# Altium schematic sheet Connectors.SchDoc
size A4; DocumentNumber: 4; SheetNumber: 4; SheetTotal: 4
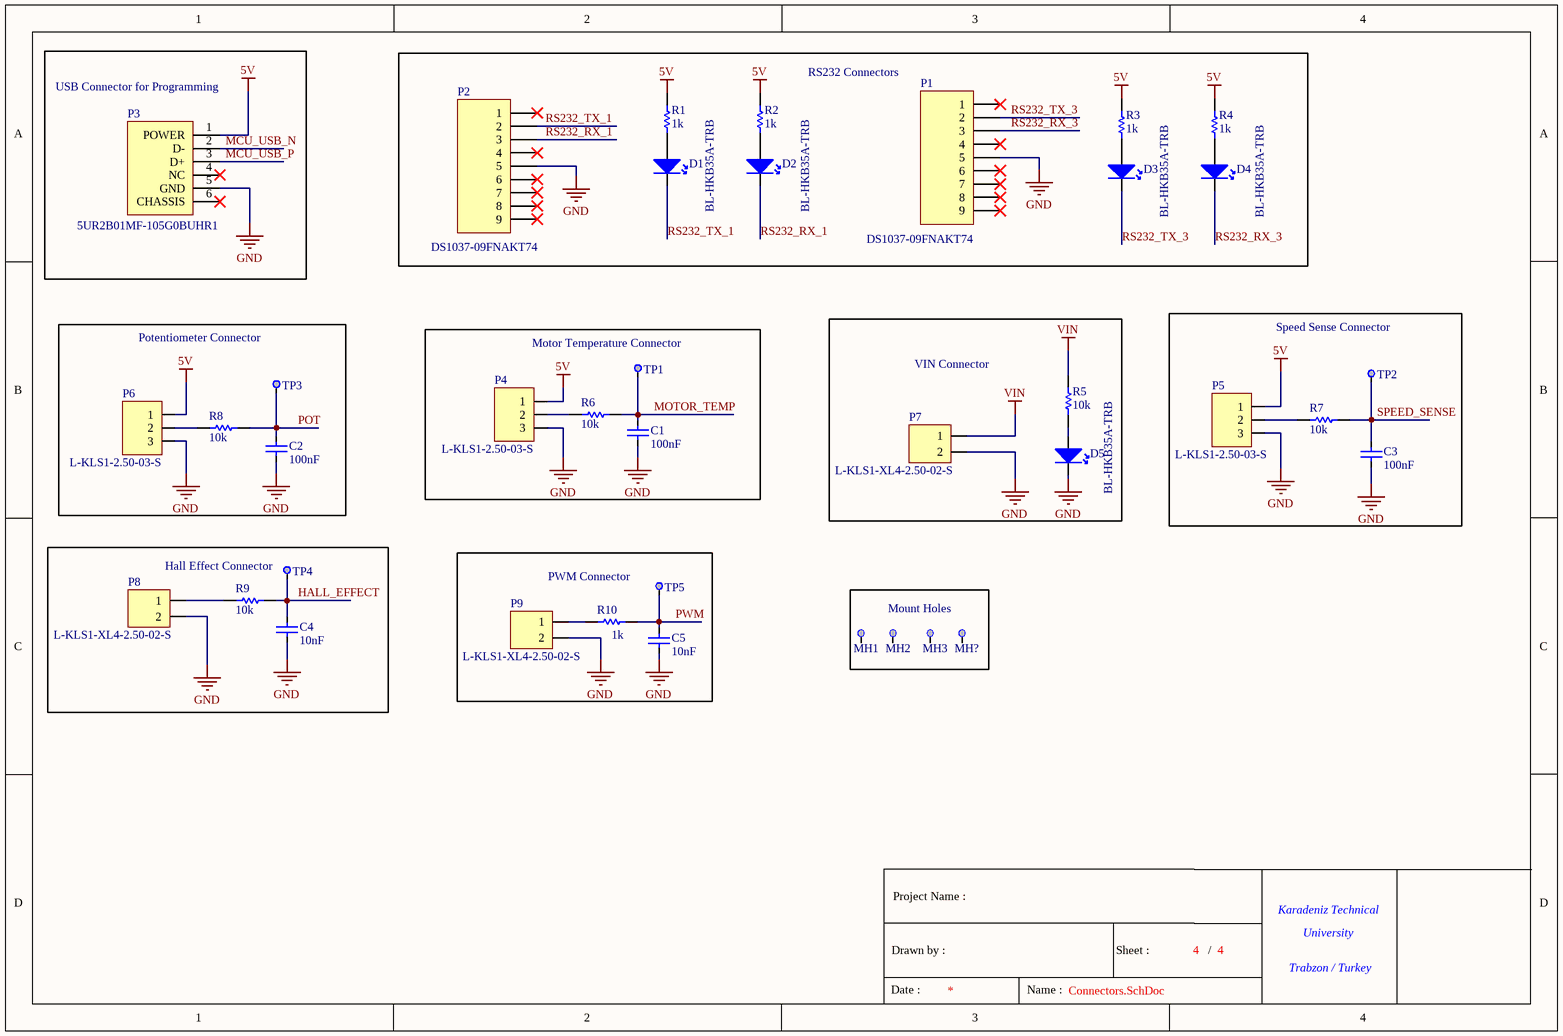
[diagram p0: Connectors.SchDoc]

## Parts
?  (no value)  (graphical)
C1  100nF  [CAP-0603]
C2  100nF  [CAP-0603]
C3  100nF  [CAP-0603]
C4  10nF  [CAP-0603]
C5  10nF  [CAP-0603]
D1  BL-HKB35A-TRB  [LED-0805]
D2  BL-HKB35A-TRB  [LED-0805]
D3  BL-HKB35A-TRB  [LED-0805]
D4  BL-HKB35A-TRB  [LED-0805]
D5  BL-HKB35A-TRB  [LED-0805]
MH1  3mm Mounting Hole  [3mm Mounting Hole]  (value not drawn)  (no BOM)
MH2  3mm Mounting Hole  [3mm Mounting Hole]  (value not drawn)  (no BOM)
MH3  3mm Mounting Hole  [3mm Mounting Hole]  (value not drawn)  (no BOM)
MH?  3mm Mounting Hole  [3mm Mounting Hole]  (value not drawn)  (no BOM)
P1  DS1037-09FNAKT74  [D SUB 9PIN FEMALE 90C TH]
P2  DS1037-09FNAKT74  [D SUB 9PIN FEMALE 90C TH]
P3  5UR2B01MF-105G0BUHR1  [MICRO USB B SMD]
P4  L-KLS1-2.50-03-S  [3PIN MALE 180C TH 2.5mm]
P5  L-KLS1-2.50-03-S  [3PIN MALE 180C TH 2.5mm]
P6  L-KLS1-2.50-03-S  [3PIN MALE 180C TH 2.5mm]
P7  L-KLS1-XL4-2.50-02-S  [2 PIN MALE 180C TH 2.50MM]
P8  L-KLS1-XL4-2.50-02-S  [2 PIN MALE 180C TH 2.50MM]
P9  L-KLS1-XL4-2.50-02-S  [2 PIN MALE 180C TH 2.50MM]
R1  1k  [RES-0603]
R2  1k  [RES-0603]
R3  1k  [RES-0603]
R4  1k  [RES-0603]
R5  10k  [RES-0603]
R6  10k  [RES-0603]
R7  10k  [RES-0603]
R8  10k  [RES-0603]
R9  10k  [RES-0603]
R10  1k  [RES-0603]
TP1  Test Point  [0.8mm Test Point]  (value not drawn)  (no BOM)
TP2  Test Point  [0.8mm Test Point]  (value not drawn)  (no BOM)
TP3  Test Point  [0.8mm Test Point]  (value not drawn)  (no BOM)
TP4  Test Point  [0.8mm Test Point]  (value not drawn)  (no BOM)
TP5  Test Point  [0.8mm Test Point]  (value not drawn)  (no BOM)

## Blocks framed on the sheet
USB Connector for Programming: P3
RS232 Connectors: D1-D4 P1 P2 R1-R4
Potentiometer Connector: C2 P6 R8 TP3
Motor Temperature Connector: C1 P4 R6 TP1
VIN Connector: D5 P7 R5
Speed Sense Connector: C3 P5 R7 TP2
Hall Effect Connector: C4 P8 R9 TP4
PWM Connector: C5 P9 R10 TP5
Mount Holes: MH1-MH3 MH?

## Nets
5V: P3.1(POWER) P4.1 P5.1 P6.1 R1.2 R2.2 R3.2 R4.2
GND: C1.1 C2.1 C3.1 C4.1 C5.2 D5.2(K) P1.5 P2.5 P3.5(GND) P4.3 P5.3 P6.3 P7.2 P8.2 P9.2
VIN: P7.1 R5.2
HALL_EFFECT: C4.2 R9.2 TP4.1
MCU_USB_N: P3.2(D-)
MCU_USB_P: P3.3(D+)
MOTOR_TEMP: C1.2 R6.2 TP1.1
POT: C2.2 R8.2 TP3.1
PWM: C5.1 R10.2 TP5.1
RS232_RX_1: D2.2(K) P2.3
RS232_RX_3: D4.2(K) P1.3
RS232_TX_1: D1.2(K) P2.2
RS232_TX_3: D3.2(K) P1.2
SPEED_SENSE: C3.2 R7.2 TP2.1
NetD1_1: D1.1(A) R1.1
NetD2_1: D2.1(A) R2.1
NetD3_1: D3.1(A) R3.1
NetD4_1: D4.1(A) R4.1
NetD5_1: D5.1(A) R5.1
NetP4_2: P4.2 R6.1
NetP5_2: P5.2 R7.1
NetP6_2: P6.2 R8.1
NetP8_1: P8.1 R9.1
NetP9_1: P9.1 R10.1

Not connected (* = marked no-connect by the designer): MH1 1; MH2 1; MH3 1; MH? 1; P1 1* 4* 6* 7* 8* 9*; P2 1* 4* 6* 7* 8* 9*; P3 4(NC)* 6(CHASSIS)*

## Notes on the sheet
- Project Name :
- Karadeniz Technical
- Date :
- Drawn by :
- Name :
- Sheet :
- /
- University
- Trabzon / Turkey

## Library data of the parts
? = Title Block: Standart Title Block
C1-C3 = CGA3E2X7R1H104K080AA: Manufacturer: TDK; Temperature Coefficient: X7R; Voltage: 50V; Library Reference: Capacitor; Tolerance: %10; Man Code: CGA3E2X7R1H104K080AA; Value: 100nF; Footprint: 0603; Component Type: Ceramic Capacitor
C4 C5 = 06031C103K4T4A: Manufacturer: AVX; Temperature Coefficient: X7R; Voltage: 100V; Library Reference: Capacitor; Tolerance: %10; Man Code: 06031C103K4T4A; Value: 10nF; Footprint: 0603; Component Type: Ceramic Capacitor
D1-D5 = BL-HKB35A-TRB: Manufacturer: BRIGHT LED; Colour: Yellow; Vf: 2.2V; Library Reference: Miscellaneous; Luminous Intensity: 94mcd; If: 20mA; Lens Transparency: Water Clear; Man Code: BL-HKB35A-TRB; Footprint: 0805; Component Type: Led
MH1-MH3 MH? = 3mm Mounting Hole: Library Reference: Miscellaneous; Component Type: Mounting Hole
P1 P2 = DS1037-09FNAKT74: Manufacturer: CONNFLY; Library Reference: Connector; Mating Connector: L-KLS1-213-09-M-L; Gender: Female; Contact Number: 9; Number of Row: 2; Mounting Angle: 90; Current(max): 1.5A; Contact Resistance(max): 20mohm; Pitch: 2.77mm; Man Code: DS1037-09FNAKT74; Component Type: D SUB 9 PIN Female Connector; Mounting Style: Through Hole
P3 = 5UR2B01MF-105G0BUHR1: Manufacturer: AMTEK; Library Reference: Connector; Mating Connector: MICRO USB B; Gender: Female; Contact Number: 5; Number of Row: 1; Mounting Angle: 90; Current(max): 1A; Contact Resistance(max): 30mohm; Pitch: 0.65mm; Man Code: 5UR2B01MF-105G0BUHR1; Component Type: MICRO USB B Connector; Mounting Style: SMD
P4-P6 = L-KLS1-2.50-03-S: Manufacturer: KLS ELECTRONIC; Library Reference: Connector; Mating Connector: L-KLS1-2.50-03-H; Gender: Male; Contact Number: 3; Number of Row: 1; Mounting Angle: 180; Current(max): 3A; Contact Resistance(max): 10mohm; Pitch: 2.5mm; Man Code: L-KLS1-2.50-03-S; Component Type: CONN 3PIN MALE 180C TH 2.5mm; Mounting Style: Through Hole
P7-P9 = L-KLS1-XL4-2.50-02-S: Manufacturer: KLS ELECTRONIC; Contact Number: 3; Contact Resistance (Max): 10mohm; Current(Max): 3A; Gender: Male; Mounting Angle: 180; Number of Row: 1; Pitch: 2.50mm; Component Type: CONN 2PIN MALE 180C TH 2.5mm; Mounting Style: THT; Man Code: L-KLS1-XL4-2.50-02-S
R1-R4 = CRCW06031K00FKEAC: Manufacturer: Vishay; Tolerance: %1; Power: 0.1W; Library Reference: Resistor; Man Code: CRCW06031K00FKEAC; Value: 1k; Footprint: 0603; Component Type: Chip Resistor
R5-R9 = CRCW060310K0FKEA: Manufacturer: Vishay; Tolerance: %1; Power: 0.1W; Library Reference: Resistor; Man Code: CRCW060310K0FKEA; Value: 10k; Footprint: 0603; Component Type: Chip Resistor
R10 = CRCW06031K00FKEAC: Manufacturer: Vishay; Library Reference: Resistor; Tolerance: %1; Power: 0.1W; Man Code: CRCW06031K00FKEAC; Footprint: 0603; Component Type: Chip Resistor; Value: 1k
TP1-TP5 = Test Point: Library Reference: Miscellaneous; Component Type: Test Point